# Altium schematic sheet Block Diagram.SchDoc
size 420 x 297 mm; Date: 22.03.2024; ApprovedBy: Arda B.; CheckedBy: Arda B.; DrawnBy: Arda Bozkurt; Revision: 001; SheetNumber: 2; SheetTotal: 9; Size: A3; Department: HDD; DOC_NO_ASSY_: __; Time: 22.03.2024
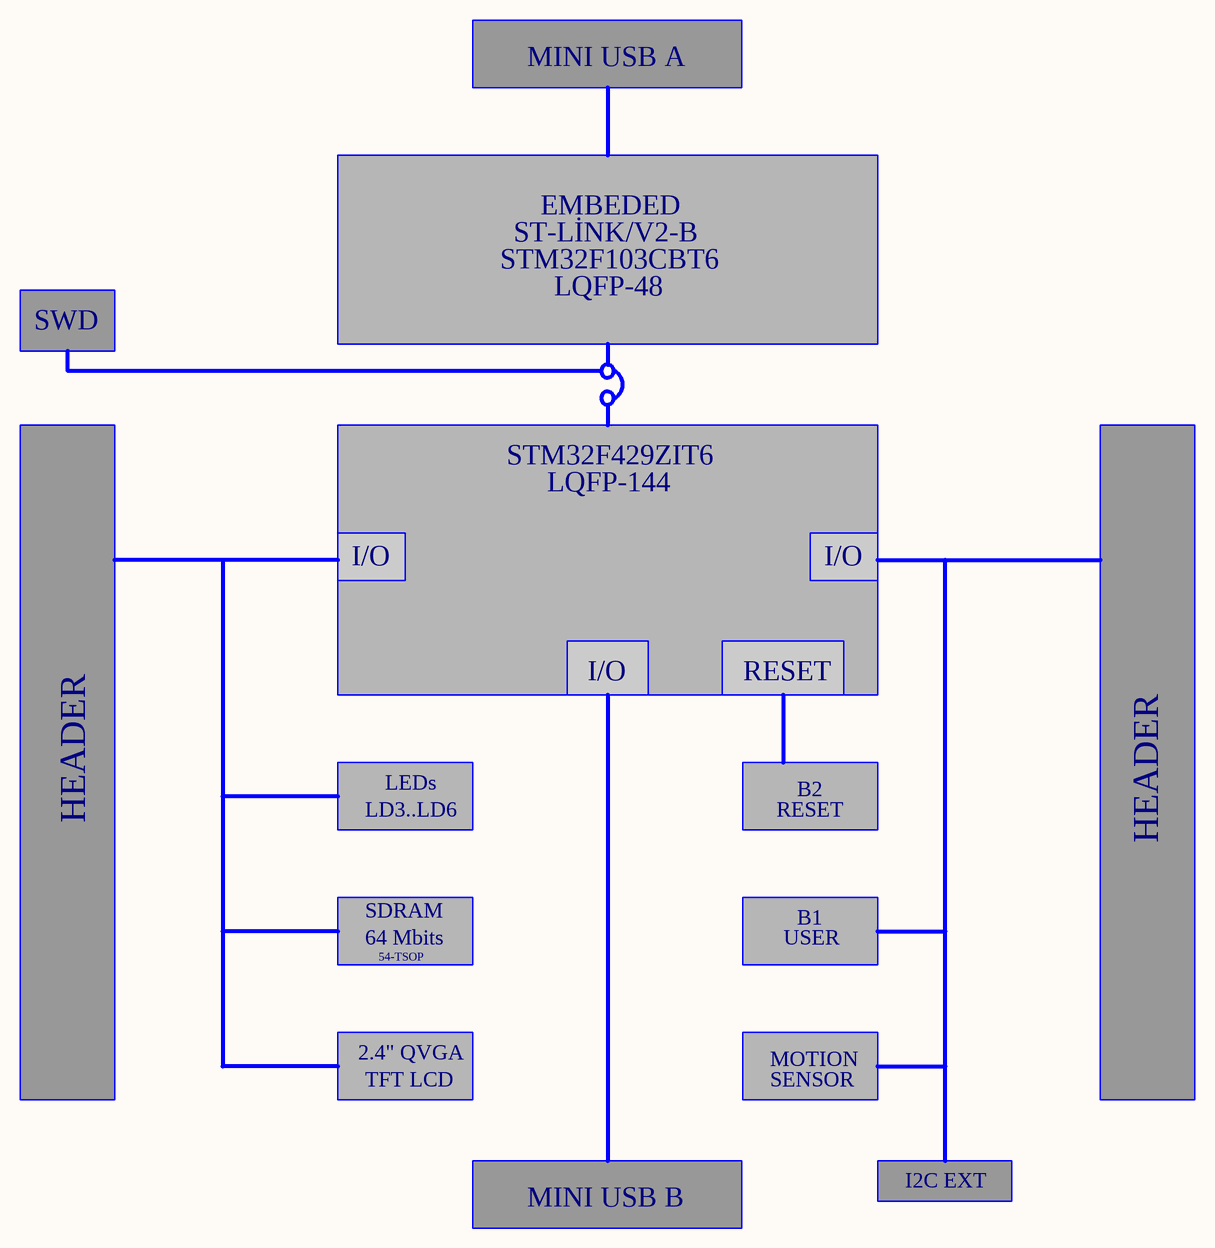
[diagram p0: Block Diagram.SchDoc]

## Notes on the sheet
- MINI USB A
- ST-LİNK/V2-B
- EMBEDED
- STM32F103CBT6
- LQFP-48
- SWD
- STM32F429ZIT6
- LQFP-144
- I/O
- RESET
- HEADER
- LD3..LD6
- LEDs
- B2
- SDRAM
- 64 Mbits
- 54-TSOP
- USER
- B1
- 2.4" QVGA
- TFT LCD
- MOTION
- SENSOR
- I2C EXT
- MINI USB B
- REVİSİON
- DESCRIPTION
- DATE
- APPROVED
- DWG NO:
- TAINIM/DESCRIPTION
- REV:
- DOSYA ADI/FİLE NAME
- HAZIRLAYAN/PREPARED BY
- KONTROL EDEN/ CHECKED BY
- YAYIN TARİHİ/REL. DATE
- DEĞ TARİHİ/CHANCE DATE
- ONAYLAYAN/APPROVED BY
- REVİZYON/REVISION
- Arda Bozkurt
- BÖLÜM/DEPARTMENT
- BOYUT/SİZE
- SAYFA/SHEET
- of